# Altium schematic sheet Revision.SchDoc
size A4; Author: Audran; CompanyName: Goldorak; Address1: Electrolab; Address2: 52 rue Paul Lescop; Address3: 92000 Nanterre; ProjectName: Cartes_2017
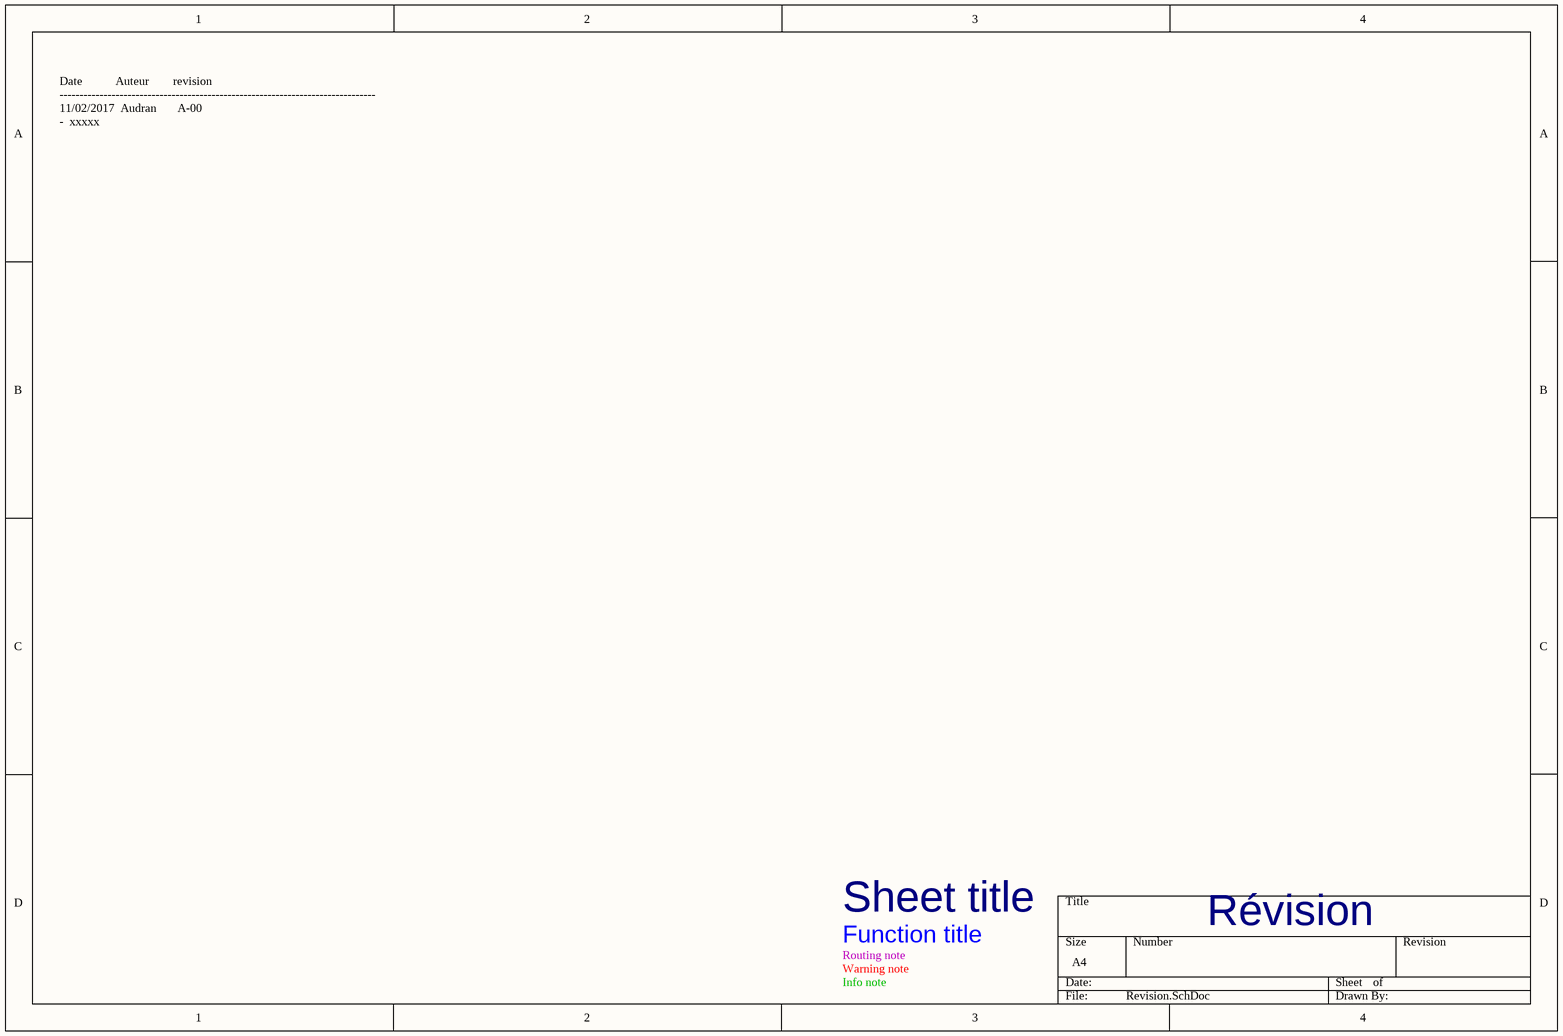
[diagram p0: Revision.SchDoc]

## Notes on the sheet
- Date           Auteur        revision
  -------------------------------------------------------------------------------
  11/02/2017  Audran       A-00
  -  xxxxx
- Sheet title
- Routing note
- Warning note
- Info note
- Function title
- Révision